# EAGLE design pcbcsmd (EAGLE 9.6.1)
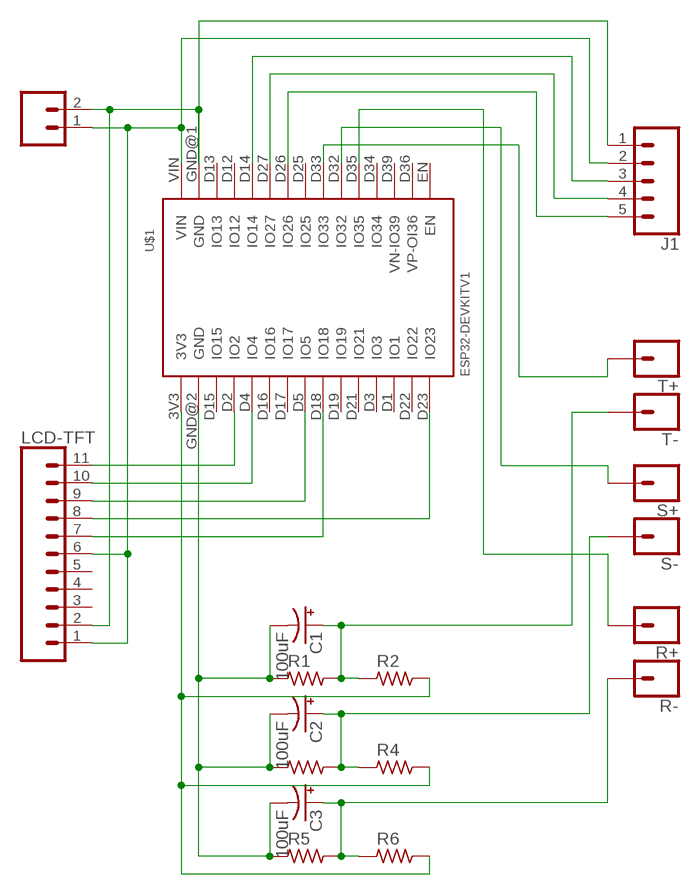
[diagram p0: schematic, sheet 1]

## Parts
C1  100uF  100UF-POLAR-25V-20%(ELEC)  [PANASONIC_D]
C2  100uF  100UF-POLAR-25V-20%(ELEC)  [PANASONIC_D]
C3  100uF  100UF-POLAR-25V-20%(ELEC)  [PANASONIC_D]
J1  CONN_05  [1X05]
LCD-TFT  CONN_11  [1X11]
POWER  CONN_02  [1X02]
R1  R_0805  [R0805]
R2  R_0805  [R0805]
R3  R_0805  [R0805]
R4  R_0805  [R0805]
R5  R_0805  [R0805]
R6  R_0805  [R0805]
R+  CONN_01  [1X01]
R-  CONN_01  [1X01]
S+  CONN_01  [1X01]
S-  CONN_01  [1X01]
T+  CONN_01  [1X01]
T-  CONN_01  [1X01]
U$1  ESP32DEVKITV1  [ESP32-DEVKITV1]

## Nets
N$1: T+.1 U$1.D33(IO33)
N$4: R2.2 R4.2 R6.2 U$1.3V3
N$5: C3.+ R5.2 R6.1 R-.1
N$6: C2.+ R3.2 R4.1 S-.1
N$7: C1.+ R1.2 R2.1 T-.1
N$8: LCD-TFT.11 U$1.D2(IO2)
N$9: LCD-TFT.10 U$1.D4(IO4)
N$10: C1.- C2.- C3.- R1.1 R3.1 R5.1 U$1.GND@2(GND)
N$11: LCD-TFT.7 U$1.D18(IO18)
N$12: LCD-TFT.8 U$1.D23(IO23)
N$13: S+.1 U$1.D32(IO32)
N$14: R+.1 U$1.D35(IO35)
N$15: LCD-TFT.9 U$1.D5(IO5)
N$17: J1.5 U$1.D26(IO26)
N$18: J1.4 U$1.D27(IO27)
N$19: J1.3 U$1.D14(IO14)
N$20: J1.1 LCD-TFT.2 POWER.2 U$1.GND@1(GND)
N$21: J1.2 LCD-TFT.1 LCD-TFT.6 POWER.1 U$1.VIN
Unconnected: LCD-TFT.3 LCD-TFT.4 LCD-TFT.5 U$1.D1(IO1) U$1.D3(IO3) U$1.D12(IO12) U$1.D13(IO13) U$1.D15(IO15) U$1.D16(IO16) U$1.D17(IO17) U$1.D19(IO19) U$1.D21(IO21) U$1.D22(IO22) U$1.D25(IO25) U$1.D34(IO34) U$1.D36(VP-OI36) U$1.D39(VN-IO39) U$1.EN

## Library data of the parts
C1-C3 = SparkFun-Capacitors:100UF-POLAR: 100µF polarized capacitors A capacitor is a passive two-terminal electrical component used to store electrical energy temporarily in an electric field.; PROD_ID: CAP-12547
J1 = SparkFun-Connectors:CONN_05: Multi connection point. Often used as Generic Header-pin footprint for 0.1 inch spaced/style header connections On any of the 0.1 inch spaced packages, you can populate with these: Break Away Headers - Straight <https://www.sparkfun.com/products/116> (PRT-00116) Break Away Male Headers - Right Angle <https://www.sparkfun.com/products/553> (PRT-00553) Female Headers <https://www.sparkfun.com/products/115> (PRT-00115) Break Away Headers - Machine Pin <https://www.sparkfun.com/products/117> (PRT-00117) Break Away Female Headers - Swiss Machine Pin <https://www.sparkfun.com/products/743> (PRT-00743) For SCREWTERMINALS and SPRING TERMINALS visit here: Screw Terimnals on SparkFun.com <https://www.sparkfun.com/search/results?term=Screw+Terminals> (5mm/3.5mm/2.54mm spacing) This device is also useful as a general connection point to wire up your design to another part of your project. Our various solder wires solder well into these plated through hole pads. Hook-Up Wire - Assortment (Stranded, 22 AWG) <https://www.sparkfun.com/products/11375> (PRT-11375) Hook-Up Wire - Assortment (Solid Core, 22 AWG) <https://www.sparkfun.com/products/11367> (PRT-11367) View the entire wire category on our website here <https://www.sparkfun.com/categories/141> Special notes: Molex polarized connector foot print use with SKU : PRT-08231 with associated crimp pins and housings. 1MM SMD Version SKU: PRT-10208
LCD-TFT = SparkFun-Connectors:CONN_11: Multi connection point. Often used as Generic Header-pin footprint for 0.1 inch spaced/style header connections On any of the 0.1 inch spaced packages, you can populate with these: Break Away Headers - Straight <https://www.sparkfun.com/products/116> (PRT-00116) Break Away Male Headers - Right Angle <https://www.sparkfun.com/products/553> (PRT-00553) Female Headers <https://www.sparkfun.com/products/115> (PRT-00115) Break Away Headers - Machine Pin <https://www.sparkfun.com/products/117> (PRT-00117) Break Away Female Headers - Swiss Machine Pin <https://www.sparkfun.com/products/743> (PRT-00743) For SCREWTERMINALS and SPRING TERMINALS visit here: Screw Terimnals on SparkFun.com <https://www.sparkfun.com/search/results?term=Screw+Terminals> (5mm/3.5mm/2.54mm spacing) This device is also useful as a general connection point to wire up your design to another part of your project. Our various solder wires solder well into these plated through hole pads. Hook-Up Wire - Assortment (Stranded, 22 AWG) <https://www.sparkfun.com/products/11375> (PRT-11375) Hook-Up Wire - Assortment (Solid Core, 22 AWG) <https://www.sparkfun.com/products/11367> (PRT-11367) View the entire wire category on our website here <https://www.sparkfun.com/categories/141>
POWER = SparkFun-Connectors:CONN_02: Multi connection point. Often used as Generic Header-pin footprint for 0.1 inch spaced/style header connections On any of the 0.1 inch spaced packages, you can populate with these: Break Away Headers - Straight <https://www.sparkfun.com/products/116> (PRT-00116) Break Away Male Headers - Right Angle <https://www.sparkfun.com/products/553> (PRT-00553) Female Headers <https://www.sparkfun.com/products/115> (PRT-00115) Break Away Headers - Machine Pin <https://www.sparkfun.com/products/117> (PRT-00117) Break Away Female Headers - Swiss Machine Pin <https://www.sparkfun.com/products/743> (PRT-00743) For SCREWTERMINALS and SPRING TERMINALS visit here: Screw Terimnals on SparkFun.com <https://www.sparkfun.com/search/results?term=Screw+Terminals> (5mm/3.5mm/2.54mm spacing) This device is also useful as a general connection point to wire up your design to another part of your project. Our various solder wires solder well into these plated through hole pads. Hook-Up Wire - Assortment (Stranded, 22 AWG) <https://www.sparkfun.com/products/11375> (PRT-11375) Hook-Up Wire - Assortment (Solid Core, 22 AWG) <https://www.sparkfun.com/products/11367> (PRT-11367) View the entire wire category on our website here <https://www.sparkfun.com/categories/141> Special notes: Molex polarized connector foot print use with: PRT-08233 with associated crimp pins and housings. 2.54_SCREWTERM for use with PRT-10571. 3.5mm Screw Terminal footprints for PRT-08084 5mm Screw Terminal footprints for use with PRT-08432
R1-R6 = rc-master-smd:R_: RESISTOR
R+ R- S+ S- T+ T- = SparkFun-Connectors:CONN_01: Single connection point. Often used as Generic Header-pin footprint for 0.1 inch spaced/style header connections On any of the 0.1 inch spaced packages, you can populate with these: Break Away Headers - Straight <https://www.sparkfun.com/products/116> (PRT-00116) Break Away Male Headers - Right Angle <https://www.sparkfun.com/products/553> (PRT-00553) Female Headers <https://www.sparkfun.com/products/115> (PRT-00115) Break Away Headers - Machine Pin <https://www.sparkfun.com/products/117> (PRT-00117) Break Away Female Headers - Swiss Machine Pin <https://www.sparkfun.com/products/743> (PRT-00743) This device is also useful as a general connection point to wire up your design to another part of your project. Our various solder wires solder well into these plated through hole pads. Hook-Up Wire - Assortment (Stranded, 22 AWG) <https://www.sparkfun.com/products/11375> (PRT-11375) Hook-Up Wire - Assortment (Solid Core, 22 AWG) <https://www.sparkfun.com/products/11367> (PRT-11367) View the entire wire category on our website here <https://www.sparkfun.com/categories/141> Special notes: SMTSO-256-ET is a "flush mount" nut for a 4-40 screw. We mostly use this on specialty testbeds; it is a nice way to connect hardware to your PCB at an adjustable hieght. Also note, the SNAP packages are for using a snappable style connector. We sell a baggie of snaps and they are also used on two LilyPad designs: Snap Assortment - 30 pack (male and female) <https://www.sparkfun.com/products/11347> (DEV-11347) LilyPad Arduino SimpleSnap <https://www.sparkfun.com/products/10941> (DEV-10941) LilyPad SimpleSnap Protoboard <https://www.sparkfun.com/products/10940> (DEV-10940)
U$1 = ESP32-DEVKITV1:ESP32DEVKITV1

## Board
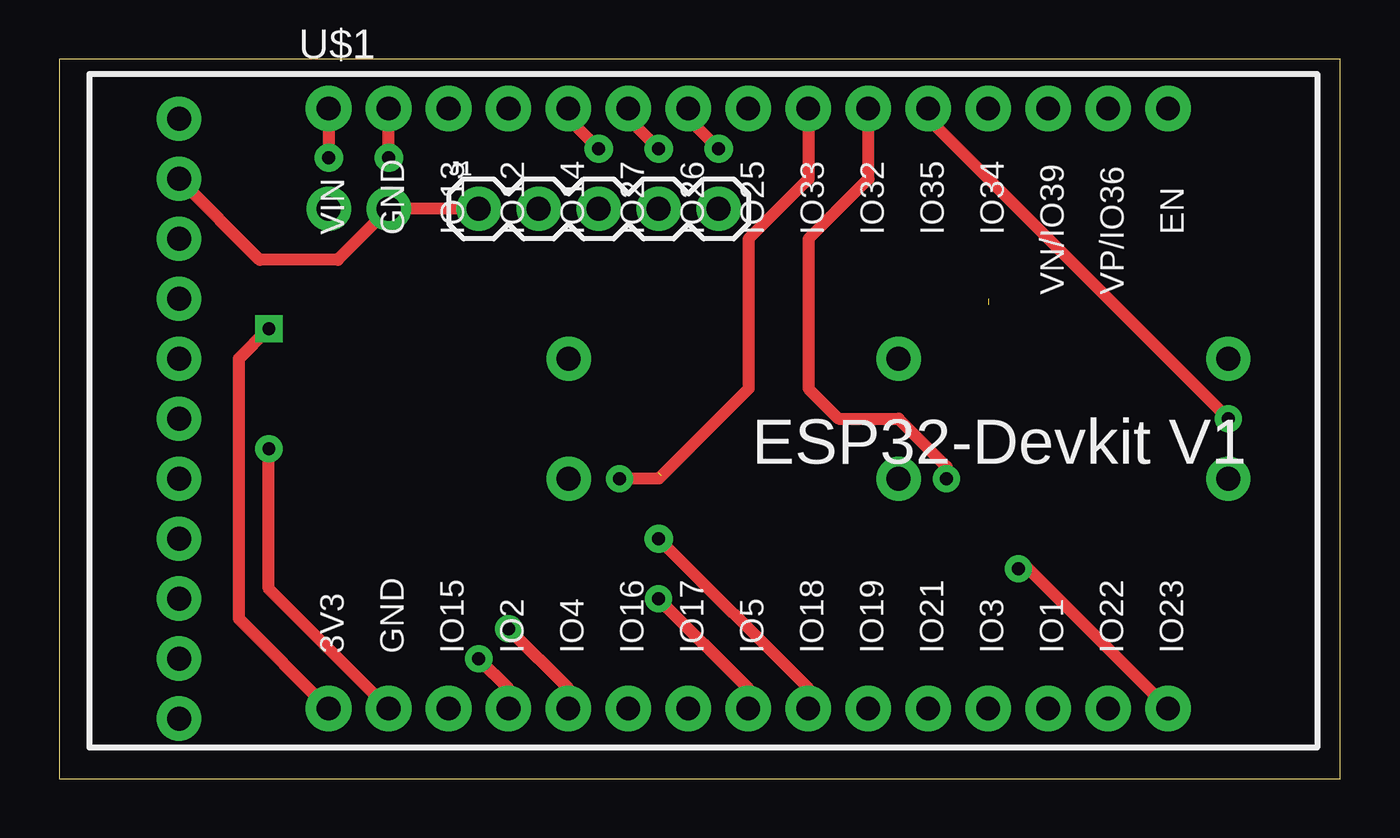
[diagram p1: board, top side]
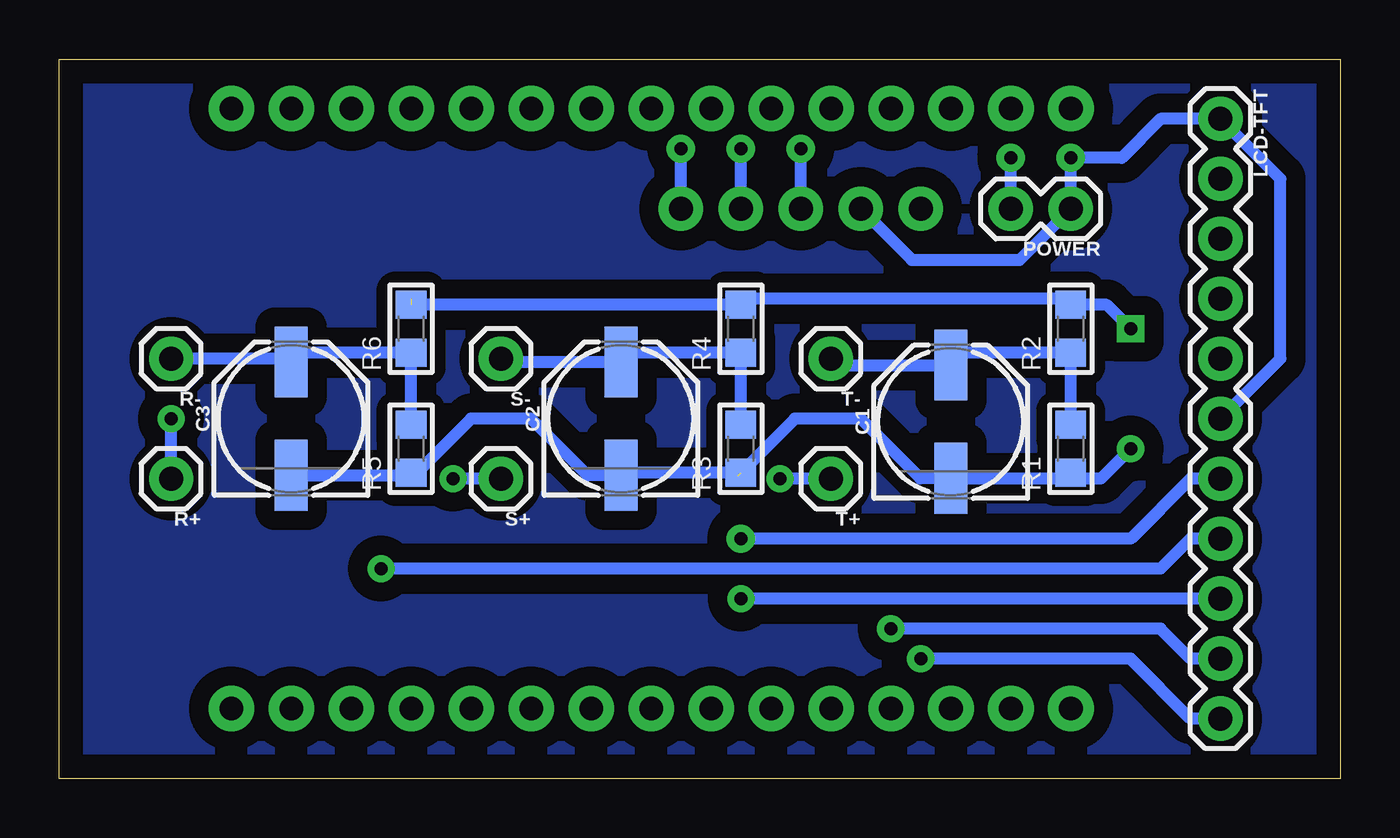
[diagram p2: board, bottom side, seen from below]

Size 54.28 x 30.47 mm. Coordinates in mm from the lower left corner, seen from the top.
Outline: 0,0 54.28,0 54.28,30.47 0,30.47 0,0
Copper layers (1*16): Top 0.035mm / dielectric 1.5mm / Bottom 0.035mm
Design rules "default": minimum track width 6mil, minimum drill 0.35mm, track to track 6mil, track to pad 6mil, pad to pad 6mil, via to via 6mil, smd to smd 6mil, copper to edge 40mil, drill to drill 6mil, minimum pad ring 10mil, minimum via ring 8mil, stop-mask expansion 4mil, vias tented up to drill 0mil, thermal gap 10mil

### Footprints (pad centres in the part's own frame; a part is rotated, then mirrored left to right if it is on the bottom)
PANASONIC_D = smd 3 x 1.4: + 2.4,0; - -2.4,0
1X05 = drill 1.016 pad 1.88: 1 0,0; 2 2.54,0; 3 5.08,0; 4 7.62,0; 5 10.16,0
1X11 = drill 1.016 pad 1.88: 1 0,0; 2 2.54,0; 3 5.08,0; 4 7.62,0; 5 10.16,0; 6 12.7,0; 7 15.24,0; 8 17.78,0; 9 20.32,0; 10 22.86,0; 11 25.4,0
1X02 = drill 1.016 pad 1.88: 1 0,0; 2 2.54,0
R0805 = smd 1.2 x 1.3: 1 -1.016,0; 2 1.016,0
1X01 = drill 1.016 pad 1.88: 1 0,0
ESP32-DEVKITV1 = drill 1 pad 1.93: 3V3 -16.52,-12.27; D1 13.96,-12.27; D2 -8.9,-12.27; D3 11.42,-12.27; D4 -6.36,-12.27; D5 1.26,-12.27; D12 -8.9,13.135; D13 -11.44,13.135; D14 -6.36,13.135; D15 -11.44,-12.27; D16 -3.82,-12.27; D17 -1.28,-12.27; D18 3.8,-12.27; D19 6.34,-12.27; D21 8.88,-12.27; D22 16.5,-12.27; D23 19.04,-12.27; D25 1.26,13.135; D26 -1.28,13.135; D27 -3.82,13.135; D32 6.34,13.135; D33 3.8,13.135; D34 11.42,13.135; D35 8.88,13.135; D36 16.5,13.135; D39 13.96,13.135; EN 19.04,13.135; GND@1 -13.98,13.135; GND@2 -13.98,-12.27; VIN -16.52,13.135

### Placement (x,y rotation side)
C1  16.51,15.11 90 bottom
C2  30.48,15.24 90 bottom
C3  44.45,15.24 90 bottom
J1  17.78,24.13 0 top
LCD-TFT  5.08,27.94 270 bottom
POWER  11.43,24.13 180 bottom
R1  11.43,13.97 90 bottom
R2  11.43,19.05 90 bottom
R3  25.4,13.97 90 bottom
R4  25.4,19.05 90 bottom
R5  39.37,13.97 90 bottom
R6  39.37,19.05 90 bottom
R+  49.53,12.7 180 bottom
R-  49.53,17.78 180 bottom
S+  35.56,12.7 180 bottom
S-  35.56,17.78 180 bottom
T+  21.59,12.7 180 bottom
T-  21.59,17.78 180 bottom
U$1  27.94,15.24 0 top

### Tracks (layer width: path | path; a pad name or v marks a point on that pad's centre or on a via)
N$1  (via drill 0.55 pad 1.15)
  Top 0.508: U$1.D33 31.75,25.4 29.21,22.86 29.21,16.51 25.4,12.7 v23.75,12.7
  Bottom 0.508: T+.1 v23.75,12.7
N$4  (via drill 0.55 pad 1.15)  (1 unrouted)
  Top 0.508: U$1.3V3 7.62,6.77 7.62,17.78 v8.89,19.05
  Bottom 0.508: 39.37,20.32 39.12,20.07 R4.2 25.4,20.32 11.68,20.32 R2.2 | R2.2 11.18,20.07 | v8.89,19.05 9.91,20.07 R2.2
N$5
  Bottom 0.406: 39.62,17.78 R6.1
  Bottom 0.508: R5.2 R6.1 44.06,18.03 C3.+ 44.59,17.78 R-.1
N$6
  Bottom 0.406: R4.1 25.65,17.78
  Bottom 0.508: R3.2 R4.1 30.09,18.03 C2.+ 35.42,17.64 S-.1
N$7
  Bottom 0.406: 11.68,17.78 R2.1
  Bottom 0.508: R1.2 R2.1 15.99,18.03 C1.+ | C1.+ 16.78,17.78 | T-.1 21.32,17.51 C1.+
N$8  (via drill 0.55 pad 1.15)
  Top 0.508: v17.78,5.08 19.04,3.82 U$1.D2
  Bottom 0.508: LCD-TFT.11 6.35,2.54 8.89,5.08 v17.78,5.08
N$9  (via drill 0.55 pad 1.15)
  Top 0.508: v19.05,6.35 21.58,3.82 U$1.D4
  Bottom 0.508: LCD-TFT.10 6.35,5.08 7.62,6.35 v19.05,6.35
N$10  (via drill 0.55 pad 1.15)  (1 unrouted)
  Top 0.508: U$1.GND@2 8.89,8.04 v8.89,13.97
  Bottom 0.406: R3.1 25.65,12.7 | R5.1 39.62,12.7
  Bottom 0.508: C3.- 39.48,12.84 R5.1 39.12,12.95 36.83,15.24 34.29,15.24 31.89,12.84 C2.- | 30.62,12.7 C2.- | R3.1 30.37,12.95 C2.- | 16.52,12.7 C1.- | C1.- 11.67,12.71 R1.1 11.3,12.83 11.18,12.7 10.16,12.7 v8.89,13.97 | C1.- 17.79,12.71 20.32,15.24 23.11,15.24 25.53,12.83
N$11  (via drill 0.55 pad 1.2)
  Top 0.508: v25.4,10.16 31.74,3.82 U$1.D18
  Bottom 0.508: LCD-TFT.7 6.35,12.7 8.89,10.16 v25.4,10.16
N$12  (via drill 0.55 pad 1.15)
  Top 0.508: v40.64,8.89 41.06,8.89 U$1.D23
  Bottom 0.508: LCD-TFT.8 6.35,10.16 7.62,8.89 v40.64,8.89
N$13  (via drill 0.55 pad 1.15)
  Top 0.508: U$1.D32 34.29,25.4 31.75,22.86 31.75,16.51 33.02,15.24 35.56,15.24 37.59,13.21 v37.59,12.7
  Bottom 0.508: S+.1 v37.59,12.7
N$14  (via drill 0.55 pad 1.15)
  Top 0.508: v49.53,15.24 36.82,27.95 U$1.D35
  Bottom 0.508: R+.1 v49.53,15.24
N$15  (via drill 0.55 pad 1.15)
  Top 0.508: v25.4,7.62 29.2,3.82 U$1.D5
  Bottom 0.508: LCD-TFT.9 v25.4,7.62
N$16
  pour Bottom (isolate 0.813): 0,30.48 54.61,30.48 54.61,0 0,0
N$17  (via drill 0.55 pad 1.2)
  Top 0.508: v27.94,26.67 26.66,27.95 U$1.D26
  Bottom 0.508: J1.5 v27.94,26.67
N$18  (via drill 0.55 pad 1.2)
  Top 0.508: v25.4,26.67 24.12,27.95 U$1.D27
  Bottom 0.508: J1.4 v25.4,26.67
N$19  (via drill 0.55 pad 1.2)
  Top 0.508: v22.86,26.67 21.58,27.95 U$1.D14
  Bottom 0.508: J1.3 v22.86,26.67
N$20  (via drill 0.55 pad 1.2)
  Top 0.508: v13.97,26.29 v13.96,26.3 U$1.GND@1 | J1.1 POWER.2 11.81,21.97 8.51,21.97 LCD-TFT.2
  Bottom 0.508: POWER.2 v13.97,26.29
N$21  (via drill 0.55 pad 1.2)
  Top 0.508: U$1.VIN v11.43,26.29
  Bottom 0.508: LCD-TFT.6 2.54,17.78 2.54,25.4 LCD-TFT.1 7.62,27.94 9.27,26.29 v11.43,26.29 POWER.1 13.59,21.97 18.16,21.97 J1.2